# Altium schematic sheet motordriver-v5.0_opto-isolation-dribbler.SchDoc
size A4; SheetNumber: 5; SheetTotal: 9
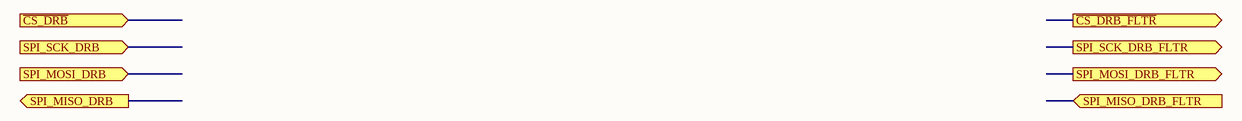
[diagram p0: motordriver-v5.0_opto-isolation-dribbler.SchDoc]

## Ports
SPI_MISO_DRB (out), SPI_MISO_DRB_FLTR (in), SPI_MOSI_DRB (in), SPI_MOSI_DRB_FLTR (out), SPI_SCK_DRB (in), SPI_SCK_DRB_FLTR (out), ~{CS_DRB_FLTR} (out), ~{CS_DRB} (in)